# Altium schematic sheet BLOCK.SchDoc
size A4; Organization: Altium Limited; Address1: L3, 12a Rodborough Rd; Address2: Frenchs Forest; Address3: NSW; Address4: Australia 2086
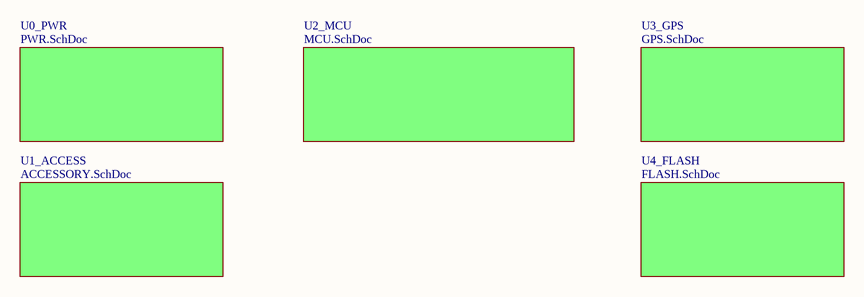
[diagram p0: BLOCK.SchDoc]

## Sub-sheets
U0_PWR = PWR.SchDoc: no entries
U1_ACCESS = ACCESSORY.SchDoc: no entries
U2_MCU = MCU.SchDoc: no entries
U3_GPS = GPS.SchDoc: no entries
U4_FLASH = FLASH.SchDoc: no entries

## Notes on the sheet
- Title
- Size:
- Date:
- A4
- Number:
- Time:
- Revision:
- Sheet
- of
- File: